# Altium schematic sheet Sdcardreader.SchDoc
size Letter; SheetNumber: 2; SheetTotal: 2
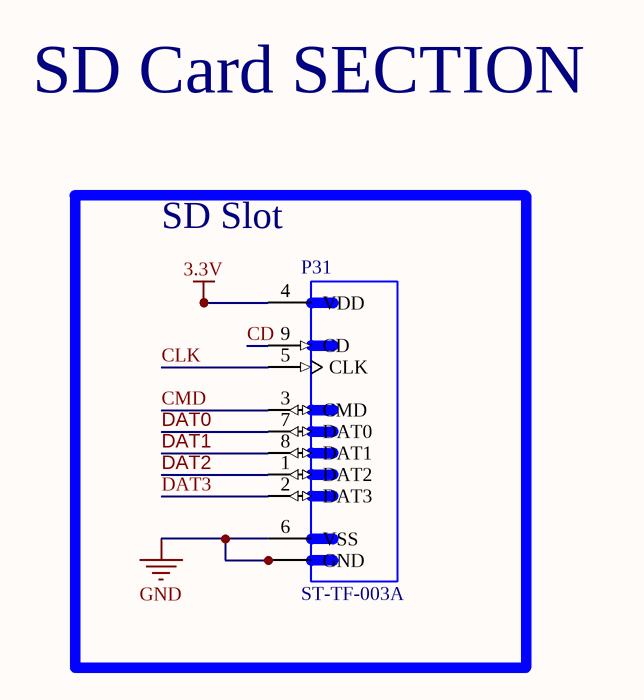
[diagram p0: Sdcardreader.SchDoc]

## Parts
P31  ST-TF-003A  [SD CD]

## Blocks framed on the sheet
SD Slot: P31

## Nets
3.3V: P31.4(VDD)
GND: P31.6(VSS) P31.G1(GND) P31.G2(GND) P31.G3(GND) P31.G4(GND)
CD: P31.9(CD)
CLK: P31.5(CLK)
CMD: P31.3(CMD)
DAT0: P31.7(DAT0)
DAT1: P31.8(DAT1)
DAT2: P31.1(DAT2)
DAT3: P31.2(DAT3)

## Notes on the sheet
- SD Card SECTION

## Library data of the parts
P31 = ST-TF-003A: Micro SD Card Socket; Price: None; MP: ST-TF-003A; Availability: Unavailable; Value: *; Package: None